# Altium schematic sheet GPS.SchDoc
size A4
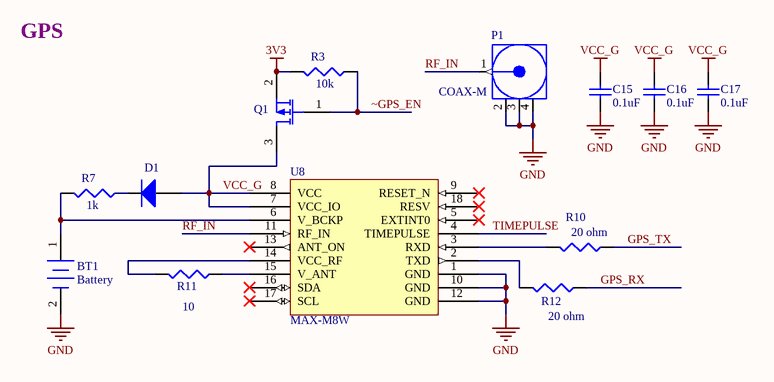
[diagram p0: GPS.SchDoc]

## Parts
BT1  Battery  [Bat Antenna MS621FE-Fl11E]
C15  value 0.1uF  [CAP_0603]  (hidden comment: Cap Semi)
C16  value 0.1uF  [CAP_0603]  (hidden comment: Cap Semi)
C17  value 0.1uF  [CAP_0603]  (hidden comment: Cap Semi)
D1  (no value)  [Diode(SOD-323 )]
P1  COAX-M  [SMA Connector]
Q1  MOSFET-P  [P-MOS (SOT323)]  (value not drawn)
R3  value 10k  [RES_0603]  (hidden comment: Res3)
R7  value 1k  [RES_0603]  (hidden comment: Res3)
R10  value 20 ohm  [RES_0603]  (hidden comment: Res3)
R11  value 10  [RES_0603]  (hidden comment: Res3)
R12  value 20 ohm  [RES_0603]  (hidden comment: Res3)
U8  MAX-M8W  [MAX-M8W]

## Nets
3V3: Q1.2(S) R3.2
GND: BT1.2(-) C15.2 C16.2 C17.2 P1.2(GND) P1.3(GND) P1.4(GND) U8.1(GND) U8.10(GND) U8.12(GND)
VCC_G: C15.1 C16.1 C17.1 D1.1(A) Q1.3(D) U8.7(VCC_IO) U8.8(VCC)
GPS_RX: R12.1
GPS_TX: R10.1
RF_IN: P1.1(Signal) U8.11(RF_IN)
TIMEPULSE: U8.4(TIMEPULSE)
~GPS_EN: Q1.1(G) R3.1
NetBT1_1: BT1.1(+) R7.2 U8.6(V_BCKP)
NetD1_2: D1.2(K) R7.1
NetR10_2: R10.2 U8.3(RXD)
NetR11_1: R11.1 U8.15(V_ANT)
NetR11_2: R11.2 U8.14(VCC_RF)
NetR12_2: R12.2 U8.2(TXD)

Not connected (* = marked no-connect by the designer): U8 5(EXTINT0)* 9(RESET_N)* 13(ANT_ON)* 16(SDA)* 17(SCL)* 18(RESV)*

## Notes on the sheet
- GPS

## Library data of the parts
BT1 = Battery: Multicell Battery; Published: 24-Mar-1999; LatestRevisionDate: 17-Jul-2002; LatestRevisionNote: Re-released for DXP Platform.; PackageReference: BAT-2; Publisher: Altium Limited; PackageDescription: Battery; 2 Leads
C15-C17 = Cap Semi: Capacitor (Semiconductor SIM Model); Published: 8-Jun-2000; LatestRevisionDate: 29-May-2009; LatestRevisionNote: IPC-7351 Footprint Added.; PackageReference: C1206; Publisher: Altium Limited; PackageDescription: Chip Capacitor
D1 = Diode: Default Diode; Published: 8-Jun-2000; LatestRevisionDate: 17-Jul-2002; LatestRevisionNote: Re-released for DXP Platform.; PackageVersion: Sep-1996; PackageReference: SMC; Publisher: Altium Limited; PackageDescription: DO-214-AB/SMC; 2 C-Bend Leads; Body 7.9 x 5.9 mm, inc. leads (LxW); Code_JEDEC: DO-214-AB
P1 = COAX-M: RF Coaxial PCB Connector, MMCX; Thru-Hole, Vertical Mount Plug,  50 Ohm Impedance; PackageDocument: Rev. A, 16-Jun-1997; PCB_Layout: Complies with manufacturer's recommendation.; DrillSize: Corresponds to nominal value.; Published: 15-Jul-2004; LatestRevisionDate: 15-Jul-2004; LatestRevisionNote: Component Replaced.; DatasheetDocument: 30-May-2003; PackageReference: 908-21103; Publisher: Altium Limited; ComponentLink1Description: Manufacturer Link; ComponentLink1URL: http://www.amphenolrf.com/
Q1 = MOSFET-P: P-Channel MOSFET; Published: 8-Jun-2000; LatestRevisionDate: 17-Jul-2002; LatestRevisionNote: Re-released for DXP Platform.; PackageVersion: 1995/1996; PackageReference: E3; Publisher: Altium Limited; PackageDescription: TO, Flat Index; 3 In-Line, Axial Leads; Body Dia. 4.6mm; Lead Dia. 0.5 mm (max)
R3 R7 R10-R12 = Res3: Resistor; Published: 8-Jun-2000; LatestRevisionDate: 29-May-2009; LatestRevisionNote: IPC-7351 Footprint Added.; PackageReference: J1-0603; Publisher: Altium Limited; PackageDescription: Chip Resistor
U8 = MAX-M8